# Altium schematic sheet Kivipallur_joonis3.SchDoc
size A4; SheetNumber: 4; SheetTotal: 4
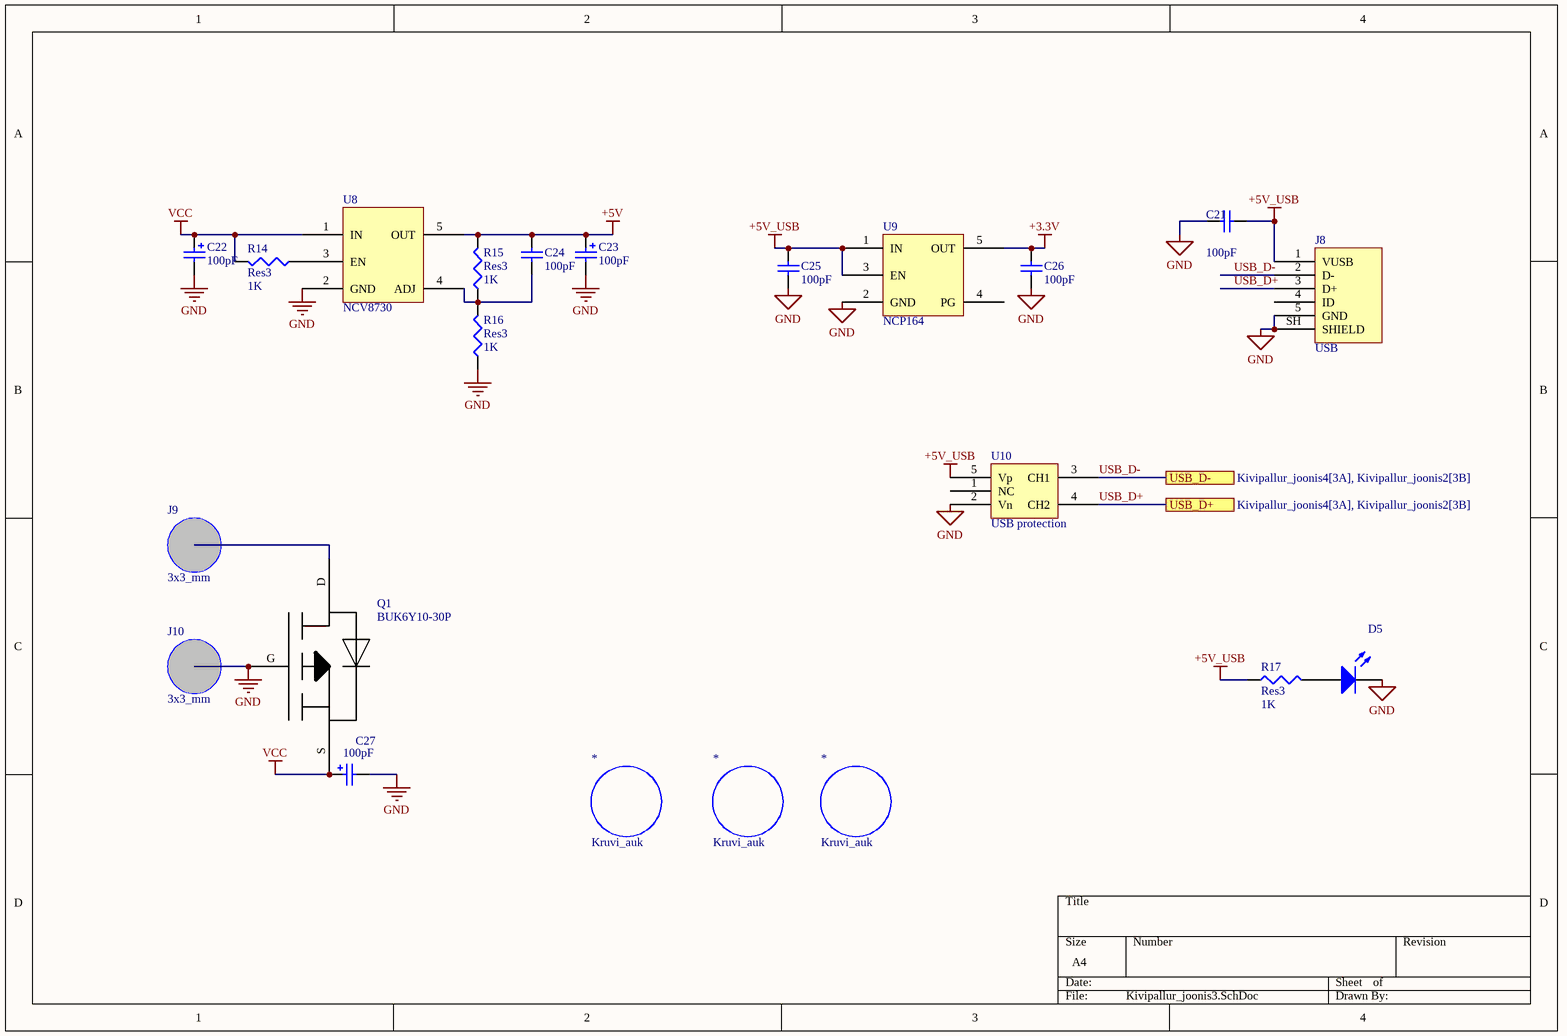
[diagram p0: Kivipallur_joonis3.SchDoc]

## Parts
(Parts that share a designator on the sheet are numbered #1, #2 ... from top to bottom, then left to right.)
*#1  Kruvi_auk  [kruvi_auk]
*#2  Kruvi_auk  [kruvi_auk]
*#3  Kruvi_auk  [kruvi_auk]
C21  value 100pF  [C1206]  (hidden comment: Cap Semi)
C22  value 100pF  [C0805]  (hidden comment: Cap Pol3)
C23  value 100pF  [C0805]  (hidden comment: Cap Pol3)
C24  value 100pF  [C1206]  (hidden comment: Cap Semi)
C25  value 100pF  [C1206]  (hidden comment: Cap Semi)
C26  value 100pF  [C1206]  (hidden comment: Cap Semi)
C27  value 100pF  [C0805]  (hidden comment: Cap Pol3)
D5  LED3  [3.5X2.8X1.9]  (value not drawn)
J8  USB  [USB]
J9  3x3_mm  [3x3_mm]
J10  3x3_mm  [3x3_mm]
Q1  BUK6Y10-30P  [BUK6Y10-30P]
R14  Res3  value 1K  [J1-0603]
R15  Res3  value 1K  [J1-0603]
R16  Res3  value 1K  [J1-0603]
R17  Res3  value 1K  [J1-0603]
U8  NCV8730  [NCV8730]
U9  NCP164  [NCP164]
U10  USB protection  [USB protection]

## Ports
USB_D+ (see Kivipallur_joonis4[3A], Kivipallur_joonis2[3B]), USB_D- (see Kivipallur_joonis4[3A], Kivipallur_joonis2[3B])

## Nets
+3.3V: C26.1 U9.5(OUT)
+5V: C23.1 C24.1 R15.2 U8.5(OUT)
+5V_USB: C21.1 C25.1 J8.1(VUSB) R17.1 U9.1(IN) U9.3(EN) U10.5(Vp)
GND: C21.2 C22.2 C23.2 C25.2 C26.2 C27.2 D5.2(K) J8.5(GND) J8.SH(SHIELD) Q1.G R16.1 U8.2(GND) U9.2(GND) U10.2(Vn)
VCC: C22.1 C27.1 Q1.S R14.2 U8.1(IN)
USB_D+: J8.3(D+) U10.4(CH2) ; port USB_D+
USB_D-: J8.2(D-) U10.3(CH1) ; port USB_D-
NetC24_2: C24.2 R15.1 R16.2 U8.4(ADJ)
NetD5_1: D5.1(A) R17.2
NetR14_1: R14.1 U8.3(EN)

Not connected (* = marked no-connect by the designer): J8 4(ID); Q1 D; U9 4(PG); U10 1(NC)

## Library data of the parts
C21 C24-C26 = Cap Semi: Capacitor (Semiconductor SIM Model); Published: 8-Jun-2000; PackageReference: C1206; Publisher: Altium Limited; PackageDescription: Chip Capacitor; LatestRevisionDate: 29-May-2009; LatestRevisionNote: IPC-7351 Footprint Added.
C22 C23 C27 = Cap Pol3: Polarized Capacitor (Surface Mount); Published: 8-Jun-2000; PackageReference: C0805; Publisher: Altium Limited; PackageDescription: Chip Capacitor; LatestRevisionDate: 29-May-2009; LatestRevisionNote: IPC-7351 Footprint Added.
D5 = LED3: Typical BLUE SiC LED; Published: 8-Jun-2000; LatestRevisionDate: 17-Dec-2003; LatestRevisionNote: PCB Footprint replaced.; PackageVersion: 16-Apr-2002; PackageReference: 3.5X2.8X1.9; Publisher: Altium Limited; PackageDescription: SM LED; 2 C-Bend Leads; Body 3.5 x 2.8 x 1.9 mm, inc leads (LxWxH typ); DatasheetVersion: 16-Apr-2002
R14-R17 = Res3: Resistor; Published: 8-Jun-2000; LatestRevisionDate: 29-May-2009; LatestRevisionNote: IPC-7351 Footprint Added.; PackageReference: J1-0603; Publisher: Altium Limited; PackageDescription: Chip Resistor